# Altium schematic sheet KA2_6.SchDoc
size 420 x 297 mm; SheetNumber: 6; SheetTotal: 6
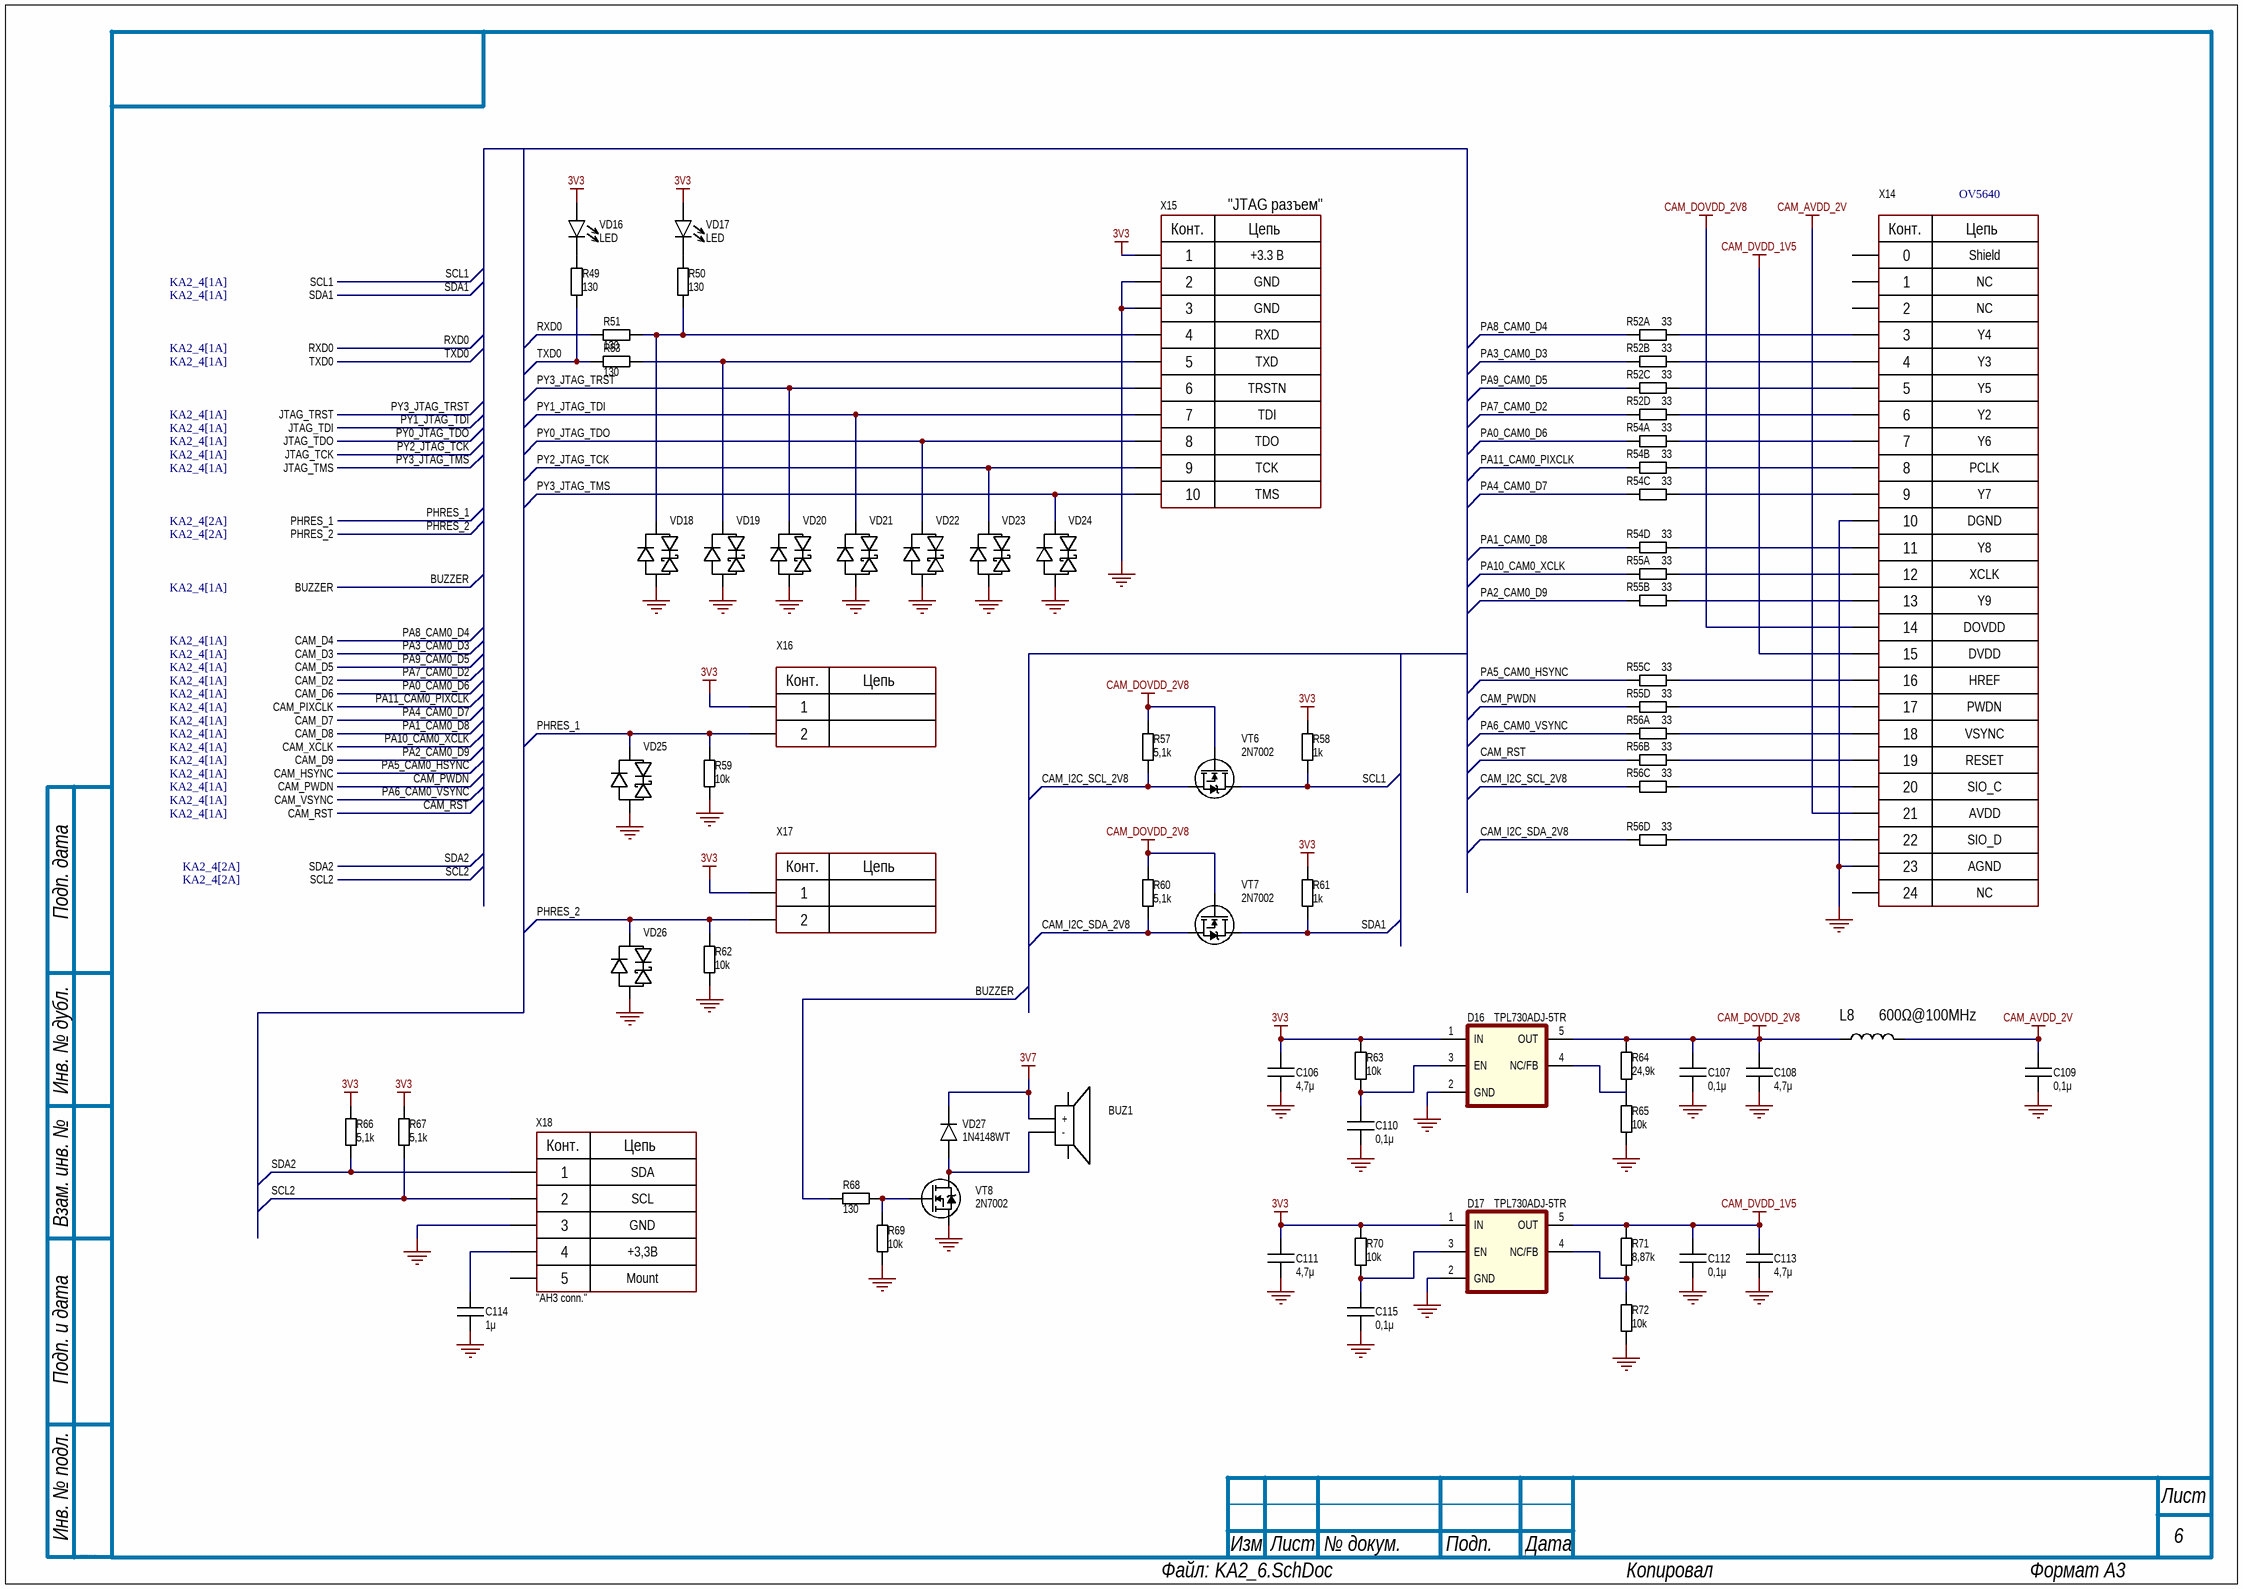
[diagram p0: KA2_6.SchDoc]

## Parts
BUZ1  SMD7525-16Ohm  [BUZZER_SMD_7.5X7.5MM]  (value not drawn)
C106  value 4,7μ  [Capacitor_0402]
C107  value 0,1μ  [Capacitor_0402]
C108  value 4,7μ  [Capacitor_0402]
C109  value 0,1μ  [Capacitor_0402]
C110  value 0,1μ  [Capacitor_0402]
C111  value 4,7μ  [Capacitor_0402]
C112  value 0,1μ  [Capacitor_0402]
C113  value 4,7μ  [Capacitor_0402]
C114  value 1μ  [Capacitor_0402]
C115  value 0,1μ  [Capacitor_0402]
D16  value TPL730ADJ-5TR  [SOT-23-5]  (hidden comment: TPL730ADJ-5TL)
D17  value TPL730ADJ-5TR  [SOT-23-5]  (hidden comment: TPL730ADJ-5TL)
L8  value 600Ω@100MHz  [IND: 0603]
R49  value 130  [RES: 0402]
R50  value 130  [RES: 0402]
R51  value 130  [RES: 0402]
R52  value 33  [RES: Array 4x0402]  (parts A,B,C,D of 4)
R53  value 130  [RES: 0402]
R54  value 33  [RES: Array 4x0402]  (parts A,B,C,D of 4)
R55  value 33  [RES: Array 4x0402]  (parts A,B,C,D of 4)
R56  value 33  [RES: Array 4x0402]  (parts A,B,C,D of 4)
R57  value 5,1k  [RES: 0402]
R58  value 1k  [RES: 0402]
R59  value 10k  [RES: 0402]
R60  value 5,1k  [RES: 0402]
R61  value 1k  [RES: 0402]
R62  value 10k  [RES: 0402]
R63  value 10k  [RES: 0402]
R64  value 24,9k  [RES: 0402]
R65  value 10k  [RES: 0402]
R66  value 5,1k  [RES: 0402]
R67  value 5,1k  [RES: 0402]
R68  value 130  [RES: 0402]
R69  value 10k  [RES: 0402]
R70  value 10k  [RES: 0402]
R71  value 8,87k  [RES: 0402]
R72  value 10k  [RES: 0402]
VD16  value LED  [LED: 0603Y]  (hidden comment: Ice Blue LED Indication - Discrete 2.8V~3.3V 0603)
VD17  value LED  [LED: 0603Y]  (hidden comment: Emerald Green 525nm LED Indication - Discrete 3.3V 0603)
VD18  D1213A-01T  [SOD-523]  (value not drawn)
VD19  D1213A-01T  [SOD-523]  (value not drawn)
VD20  D1213A-01T  [SOD-523]  (value not drawn)
VD21  D1213A-01T  [SOD-523]  (value not drawn)
VD22  D1213A-01T  [SOD-523]  (value not drawn)
VD23  D1213A-01T  [SOD-523]  (value not drawn)
VD24  D1213A-01T  [SOD-523]  (value not drawn)
VD25  D1213A-01T  [SOD-523]  (value not drawn)
VD26  D1213A-01T  [SOD-523]  (value not drawn)
VD27  value 1N4148WT  [SOD-523]  (hidden comment: Diode Independent 75V 150mA Surface Mount SOD-523)
VT6  value 2N7002  [SOT-23]  (hidden comment: N-Channel 60V 380mA 540mW Surface Mount SOT-23)
VT7  value 2N7002  [SOT-23]  (hidden comment: N-Channel 60V 380mA 540mW Surface Mount SOT-23)
VT8  value 2N7002  [SOT-23]  (hidden comment: N-Channel 60V 380mA 540mW Surface Mount SOT-23)
X14  value OV5640  [OV5640_CONNECTOR]  (hidden comment: Connector_OV5640)
X15  CommentText: "JTAG разъем"  [CONN_5x10_1.27мм_NO_SOLDERING]
X16  Connector_JST_XH_B2B-XH-A_1x02_2.50mm  [CONN_JST_XH_B2B-XH-A_1x02_P2.50mm]  (value not drawn)
X17  Connector_JST_XH_B2B-XH-A_1x02_2.50mm  [CONN_JST_XH_B2B-XH-A_1x02_P2.50mm]  (value not drawn)
X18  value "AH3 conn."  [CONN_JST_GH_SM04B]  (hidden comment: Connector Header 4 position 1.25mm Pitch)

## Ports
BUZZER (see KA2_4[1A]), CAM_D2 (see KA2_4[1A]), CAM_D3 (see KA2_4[1A]), CAM_D4 (see KA2_4[1A]), CAM_D5 (see KA2_4[1A]), CAM_D6 (see KA2_4[1A]), CAM_D7 (see KA2_4[1A]), CAM_D8 (see KA2_4[1A]), CAM_D9 (see KA2_4[1A]), CAM_HSYNC (see KA2_4[1A]), CAM_PIXCLK (see KA2_4[1A]), CAM_PWDN (see KA2_4[1A]), CAM_RST (see KA2_4[1A]), CAM_VSYNC (see KA2_4[1A]), CAM_XCLK (see KA2_4[1A]), JTAG_TCK (see KA2_4[1A]), JTAG_TDI (see KA2_4[1A]), JTAG_TDO (see KA2_4[1A]), JTAG_TMS (see KA2_4[1A]), JTAG_TRST (see KA2_4[1A]), PHRES_1 (see KA2_4[2A]), PHRES_2 (see KA2_4[2A]), RXD0 (see KA2_4[1A]), SCL1 (see KA2_4[1A]), SCL2 (see KA2_4[2A]), SDA1 (see KA2_4[1A]), SDA2 (see KA2_4[2A]), TXD0 (see KA2_4[1A])

## Nets
3V3: C106.2 C111.2 D16.1(IN) D17.1(IN) R58.2 R61.2 R63.2 R66.2 R67.2 R70.2 VD16.A(Anode) VD17.A(Anode) X15.1 X16.1 X17.1
3V7: BUZ1.2(+) VD27.K(Kathode)
CAM_AVDD_2V: C109.2 L8.1 X14.21
CAM_DOVDD_2V8: C107.2 C108.2 D16.5(OUT) L8.2 R57.2 R60.2 R64.2 VT6.1(G) VT7.1(G) X14.14
CAM_DVDD_1V5: C112.2 C113.2 D17.5(OUT) R71.2 X14.15
GND: C106.1 C107.1 C108.1 C109.1 C110.1 C111.1 C112.1 C113.1 C114.1 C115.1 D16.2(GND) D17.2(GND) R59.1 R62.1 R65.1 R69.1 R72.1 VD18.A VD19.A VD20.A VD21.A VD22.A VD23.A VD24.A VD25.A VD26.A VT8.2(S) X14.10 X14.23 X15.2 X15.3 X18.3
BUZZER: R68.2 ; port BUZZER
CAM_I2C_SCL_2V8: R56.3 R57.1 VT6.2(S)
CAM_I2C_SDA_2V8: R56.4 R60.1 VT7.2(S)
CAM_PWDN: R55.4 ; port CAM_PWDN
CAM_RST: R56.2 ; port CAM_RST
PA0_CAM0_D6: R54.1 ; port CAM_D6
PA1_CAM0_D8: R54.4 ; port CAM_D8
PA2_CAM0_D9: R55.2 ; port CAM_D9
PA3_CAM0_D3: R52.2 ; port CAM_D3
PA4_CAM0_D7: R54.3 ; port CAM_D7
PA5_CAM0_HSYNC: R55.3 ; port CAM_HSYNC
PA6_CAM0_VSYNC: R56.1 ; port CAM_VSYNC
PA7_CAM0_D2: R52.4 ; port CAM_D2
PA8_CAM0_D4: R52.1 ; port CAM_D4
PA9_CAM0_D5: R52.3 ; port CAM_D5
PA10_CAM0_XCLK: R55.1 ; port CAM_XCLK
PA11_CAM0_PIXCLK: R54.2 ; port CAM_PIXCLK
PHRES_1: R59.2 VD25.K X16.2 ; port PHRES_1
PHRES_2: R62.2 VD26.K X17.2 ; port PHRES_2
PY0_JTAG_TDO: VD22.K X15.8 ; port JTAG_TDO
PY1_JTAG_TDI: VD21.K X15.7 ; port JTAG_TDI
PY2_JTAG_TCK: VD23.K X15.9 ; port JTAG_TCK
PY3_JTAG_TMS: VD24.K X15.10 ; port JTAG_TMS
PY3_JTAG_TRST: VD20.K X15.6 ; port JTAG_TRST
RXD0: R51.2 ; port RXD0
SCL1: R58.1 VT6.3(D) ; port SCL1
SCL2: R67.1 X18.2 ; port SCL2
SDA1: R61.1 VT7.3(D) ; port SDA1
SDA2: R66.1 X18.1 ; port SDA2
TXD0: R49.1 R53.2 ; port TXD0
NetBUZ1_3: BUZ1.3(-) VD27.A(Anode) VT8.3(D)
NetC110_2: C110.2 D16.3(EN) R63.1
NetC114_2: C114.2 X18.4
NetC115_2: C115.2 D17.3(EN) R70.1
NetD16_4: D16.4(NC/FB) R64.1 R65.2
NetD17_4: D17.4(NC/FB) R71.1 R72.2
NetR49_2: R49.2 VD16.K(Kathode)
NetR50_1: R50.1 R51.1 VD18.K X15.4
NetR50_2: R50.2 VD17.K(Kathode)
NetR52_5: R52.5 X14.6
NetR52_6: R52.6 X14.5
NetR52_7: R52.7 X14.4
NetR52_8: R52.8 X14.3
NetR53_1: R53.1 VD19.K X15.5
NetR54_5: R54.5 X14.11
NetR54_6: R54.6 X14.9
NetR54_7: R54.7 X14.8
NetR54_8: R54.8 X14.7
NetR55_5: R55.5 X14.17
NetR55_6: R55.6 X14.16
NetR55_7: R55.7 X14.13
NetR55_8: R55.8 X14.12
NetR56_5: R56.5 X14.22
NetR56_6: R56.6 X14.20
NetR56_7: R56.7 X14.19
NetR56_8: R56.8 X14.18
NetR68_1: R68.1 R69.2 VT8.1(G)

Not connected (* = marked no-connect by the designer): BUZ1 1(NC) 4(NC); X14 0 1 2 24; X18 5

## Notes on the sheet
- Подп. дата
- Инв. № дубл.
- Взам. инв. №
- Подп. и дата
- Инв. № подл.
- Изм.
- Лист
- № докум.
- Подп.
- Дата
- ALTIUM GOSTBOM2.0 KEV
- Файл:
- Копировал
- Формат А3
- (in symbol Connector_AH3) Конт.; Цепь; SDA; SCL; GND; +3,3В; Mount
- (in symbol Connector_JST_XH_B2B-XH-A_1x02_2.50mm) Конт.; Цепь
- (in symbol Connector_JTAG_10) Конт.; Цепь; +3.3 В; GND; RXD; TXD; TRSTN; TDI; TDO; TCK; TMS
- (in symbol Connector_OV5640) Конт.; Цепь; Shield; NC; Y4; Y3; Y5; Y2; Y6; PCLK; Y7; DGND; Y8; XCLK; Y9; DOVDD; DVDD; HREF; PWDN; VSYNC; RESET; SIO_C; AVDD; SIO_D; AGND

## Library data of the parts
BUZ1 = SMD7525-16Ohm: Буззер электромагнитный SMD, 7.5x7.5x2.5mm; Manufacturer: XHXDZ; Mfr.Part: SMD7525-16Ω; Value: Buzzer; HelpURL: https://www.lcsc.com/product-detail/C49246950.html
C106 C108 C111 C113 = Ceramic_0402: ValueManufacturerPartNumber: Ceramic capacitor, 4,7μ, X7R, ±10%, 16V, 0402; TypeCapacitor: Ceramic capacitor; Tolerance: ±10%; TypeDielectric: X7R; Voltage: 16V; Manufacturer: *; HelpURL: *; Package: 0402; Mfr.Part: *
C107 C109 C110 C112 C115 = Ceramic_0402: ValueManufacturerPartNumber: Ceramic capacitor, 0,1μ, X7R, ±10%, 16V, 0402; TypeCapacitor: Ceramic capacitor; Tolerance: ±10%; TypeDielectric: X7R; Voltage: 16V; Manufacturer: *; HelpURL: *; Package: 0402; Mfr.Part: *
C114 = Ceramic_0402: ValueManufacturerPartNumber: Ceramic capacitor, 1μ, X7R, ±10%, 16V, 0402; TypeCapacitor: Ceramic capacitor; Tolerance: ±10%; TypeDielectric: X7R; Voltage: 16V; Manufacturer: *; HelpURL: *; Package: 0402; Mfr.Part: *
D16 D17 = TPL730ADJ-5TL: Микросхема драйвера импульсного понижающего преобразователя; Manufacturer: 3PEAK; Mfr.Part: TPL730ADJ-5TR; HelpURL: https://www.lcsc.com/product-detail/C2690181.html
L8 = Inductor_0603: ValueManufacturerPartNumber: Inductor, 600Ω@100MHz, ±10%, 0603; Tolerance: ±10%; Manufacturer: *; Mfr.Part: *; Package: 0603; HelpURL: *; TypeInductor: Inductor
R49-R51 R53 R68 = Resistor_0402: ValueManufacturerPartNumber: Resistor, 130, ±1%, 0402; Tolerance: ±1%; Manufacturer: *; Package: 0402; Mfr.Part: *; TypeResistor: Resistor; HelpURL: *
R52 R54-R56 = ResistorArray_0402_4: ValueManufacturerPartNumber: Resistor array (4), 33, ±1%, 0402; TypeResistor: Resistor array (4); Tolerance: ±1%; Manufacturer: *; Mfr.Part: *; Package: 0402; HelpURL: *
R57 R60 R66 R67 = Resistor_0402: ValueManufacturerPartNumber: Resistor, 5,1k, ±1%, 0402; Tolerance: ±1%; Manufacturer: *; Package: 0402; Mfr.Part: *; TypeResistor: Resistor; HelpURL: *
R58 R61 = Resistor_0402: ValueManufacturerPartNumber: Resistor, 1k, ±1%, 0402; Tolerance: ±1%; Manufacturer: *; Package: 0402; Mfr.Part: *; TypeResistor: Resistor; HelpURL: *
R59 R62 R63 R65 R69 R70 R72 = Resistor_0402: ValueManufacturerPartNumber: Resistor, 10k, ±1%, 0402; Tolerance: ±1%; Manufacturer: *; Package: 0402; Mfr.Part: *; TypeResistor: Resistor; HelpURL: *
R64 = Resistor_0402: ValueManufacturerPartNumber: Resistor, 24,9k, ±1%, 0402; Tolerance: ±1%; Manufacturer: *; Package: 0402; Mfr.Part: *; TypeResistor: Resistor; HelpURL: *
R71 = Resistor_0402: ValueManufacturerPartNumber: Resistor, 8,87k, ±1%, 0402; Tolerance: ±1%; Manufacturer: *; Package: 0402; Mfr.Part: *; TypeResistor: Resistor; HelpURL: *
VD16 = LED_0603_IB: Светодиод ледяной синий, 0603; Mfr.Part: A-SP192GB1D-A02-4T; Manufacturer: Amicc; HelpURL: https://www.lcsc.com/product-detail/C5355458.html
VD17 = LED_0603_EG: Светодиод изумрудно-зеленый, 0603; Mfr.Part: XL-1608UGC-04; Manufacturer: XINGLIGHT; HelpURL: https://www.lcsc.com/product-detail/C965804.html
VD18-VD26 = D1213A-01T: Manufacturer: Diodes; Mfr.Part: D1213A-01T-7; Value: D1213A-01T-7; HelpURL: https://www.lcsc.com/product-detail/C460584.html
VD27 = 1N4148WT: Диод кремниевый 100В 300мА, SOD-123; Manufacturer: JSMSEMI; Mfr.Part: 1N4148WT; HelpURL: https://www.lcsc.com/product-detail/C917006.html
VT6-VT8 = 2N7002: Транзистор N-канальный, 60В 115мА 200мВт, SOT-23; Mfr.Part: 2N7002K-7; Manufacturer: Diodes; HelpURL: https://www.lcsc.com/product-detail/C85047.html
X14 = Connector_OV5640: Manufacturer: kinghelm; Mfr.Part: KH-FG0.5-H2.0-24PIN; HelpURL: https://www.lcsc.com/product-detail/C2797213.html
X15 = Connector_JTAG_10: Edge-board JTAG connector including TRST; Manufacturer: JST; ValueManufacturerPartNumber: Connector, 2pin, 2.5 mm, 250V, 3A; PartNumber: B2B-EH-A; VoltageMax: 250V; Pitch: 2.5 mm; CurrentMax: 3A; Multichannel: 2pin; HelpURL: https://www.digikey.com/product-detail/en/jst-sales-america-inc/B2B-EH-A-LF-SN/455-1611-ND/926520; TypeConnector: Connector
X16 X17 = Connector_JST_XH_B2B-XH-A_1x02_2.50mm: 2-pin through-hole connector
X18 = Connector_AH3: Manufacturer: CJT(Changjiang Connectors); Mfr.Part: A1257WR-S-4P; HelpURL: https://www.lcsc.com/product-detail/C225127.html